# EAGLE design ESP12E Breakout Adapter (EAGLE 7.3.0)
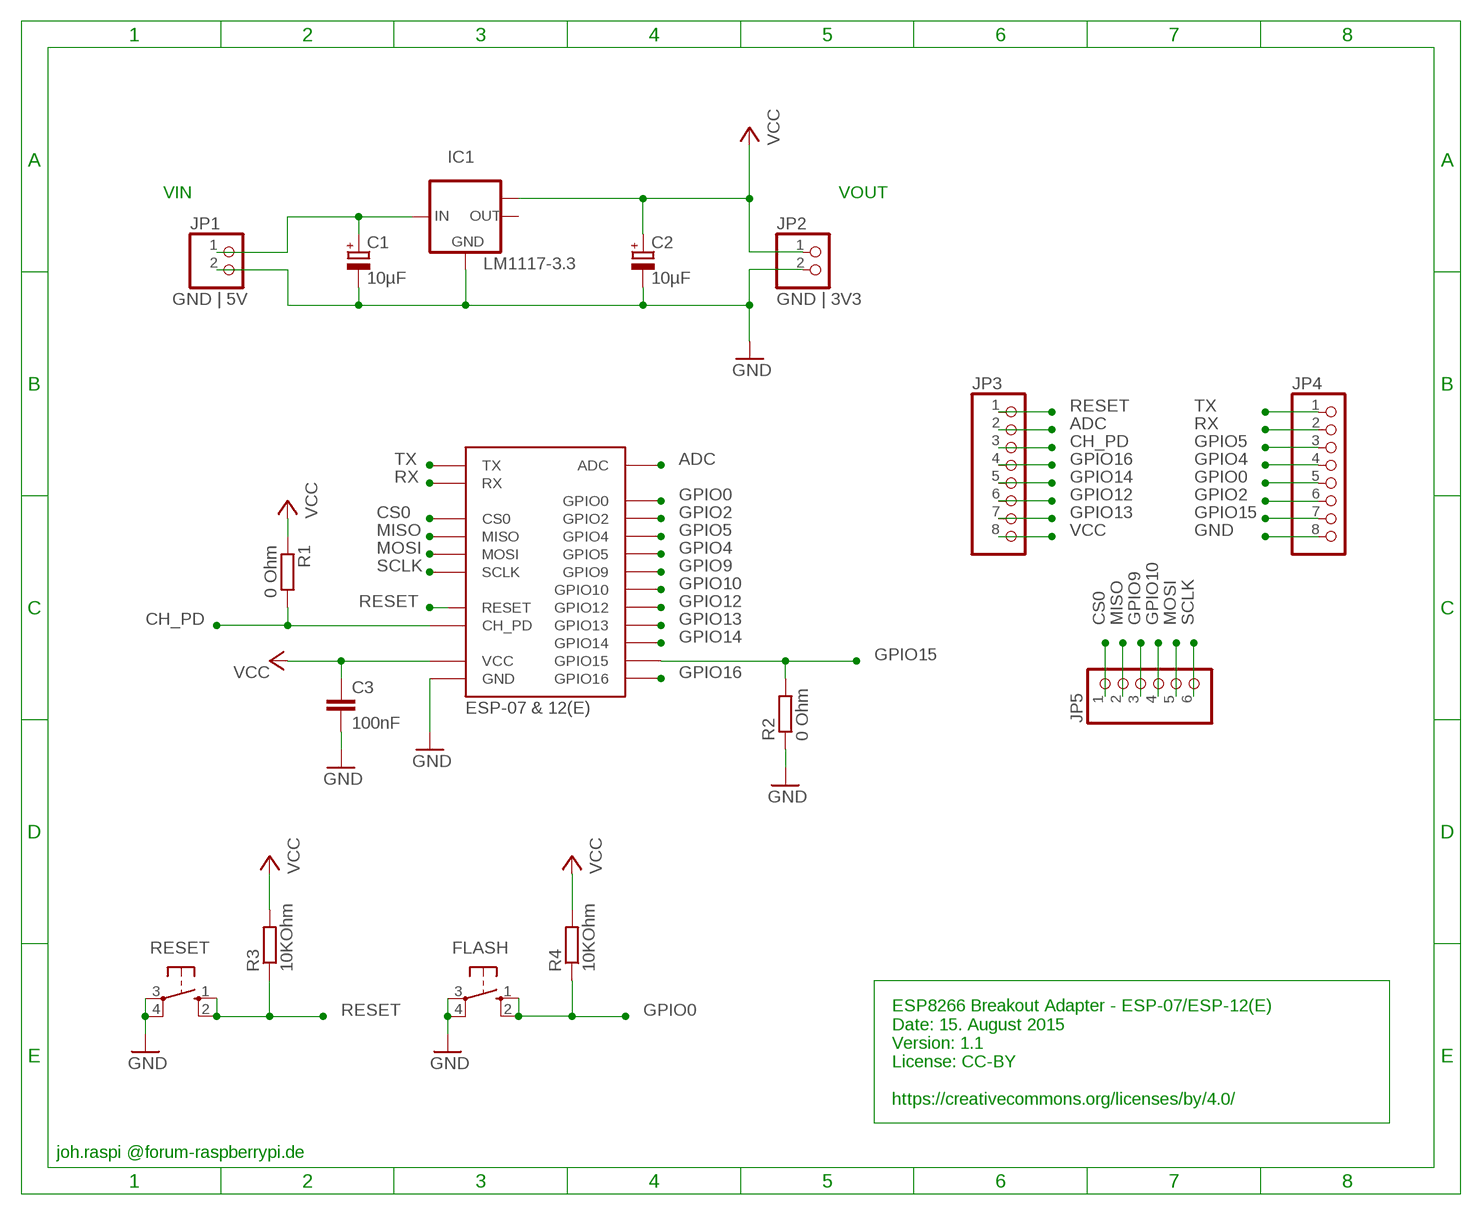
[diagram p0: schematic, sheet 1]

## Parts
C1  10µF  CPOL-EUB/3528-21W  [B/3528-21W]
C2  10µF  CPOL-EUB/3528-21W  [B/3528-21W]
C3  100nF  C-EUC0805K  [C0805K]
ESP8266  ESP-07 & 12(E)  ESP-12-E  [ESP-12-E]
FLASH_SWITCH  FLASH  10-XX  [B3F-10XX]
IC1  LM1117-3.3  LM1117MPX-3.3  [SOT223]
JP1  GND | 5V  PINHD-1X2  [1X02]
JP2  GND | 3V3  PINHD-1X2  [1X02]
JP3  PINHD-1X8  [1X08]
JP4  PINHD-1X8  [1X08]
JP5  PINHD-1X6  [1X06]
R1  0 Ohm  R-EU_R0805  [R0805]
R2  0 Ohm  R-EU_R0805  [R0805]
R3  10KOhm  R-EU_R0805  [R0805]
R4  10KOhm  R-EU_R0805  [R0805]
RESET_SWITCH  RESET  10-XX  [B3F-10XX]

## Nets
ADC: ESP8266.ADC JP3.2
CH_PD: ESP8266.CH_PD JP3.3 R1.2
CS0: ESP8266.CS0 JP5.1
GND [a]: C1.- C2.- C3.2 ESP8266.GND FLASH_SWITCH.3(P) FLASH_SWITCH.4(P1) IC1.1(GND) JP1.2 JP2.2 JP4.8 R2.1 RESET_SWITCH.3(P) RESET_SWITCH.4(P1)
GPIO0: ESP8266.GPIO0 FLASH_SWITCH.1(S) FLASH_SWITCH.2(S1) JP4.5 R4.1
GPIO2: ESP8266.GPIO2 JP4.6
GPIO4: ESP8266.GPIO5 JP4.4
GPIO5: ESP8266.GPIO4 JP4.3
GPIO9: ESP8266.GPIO9 JP5.3
GPIO10: ESP8266.GPIO10 JP5.4
GPIO12: ESP8266.GPIO12 JP3.6
GPIO13: ESP8266.GPIO13 JP3.7
GPIO14: ESP8266.GPIO14 JP3.5
GPIO15: ESP8266.GPIO15 JP4.7 R2.2
GPIO16: ESP8266.GPIO16 JP3.4
MISO: ESP8266.MISO JP5.2
MOSI: ESP8266.MOSI JP5.5
RESET: ESP8266.RESET JP3.1 R3.1 RESET_SWITCH.1(S) RESET_SWITCH.2(S1)
RX: ESP8266.RX JP4.2
SCLK: ESP8266.SCLK JP5.6
TX: ESP8266.TX JP4.1
VCC: C2.+ C3.1 ESP8266.VCC IC1.TAB(OUT1) JP2.1 JP3.8 R1.1 R3.2 R4.2
VIN: C1.+ IC1.3(IN) JP1.1
Unconnected: IC1.2(OUT)

## Notes on the sheet
- VIN | VOUT
- ESP8266 Breakout Adapter - ESP-07/ESP-12(E)
  Date: 15. August 2015
  Version: 1.1
  License: CC-BY
  
  https://creativecommons.org/licenses/by/4.0/
- joh.raspi @forum-raspberrypi.de

## Library data of the parts
C1 C2 = rcl:CPOL-EU: POLARIZED CAPACITOR, European symbol
C3 = rcl:C-EU: CAPACITOR, European symbol
ESP8266 = johs_esp8266_lib_frank_esp12e_mod:ESP-12-E: ESP8266 Wifi Module ESP-12-E; DIMENSIONS: 24.0 x 16.0 mm; PINS: 22; PITCH: 0.078" / 2 mm
FLASH_SWITCH RESET_SWITCH = switch-omron:10-XX: OMRON SWITCH; MPN: B3F-1000; OC_FARNELL: 176432; OC_NEWARK: 36M3542
IC1 = lm1117:LM1117MPX-*
JP1 JP2 = pinhead:PINHD-1X2: PIN HEADER
JP3 JP4 = pinhead:PINHD-1X8: PIN HEADER
JP5 = pinhead:PINHD-1X6: PIN HEADER
R1-R4 = rcl:R-EU_: RESISTOR, European symbol

## Net classes
1 a: width 0.203 mm, drill 0.305 mm, clearance 0.203 mm

## Board
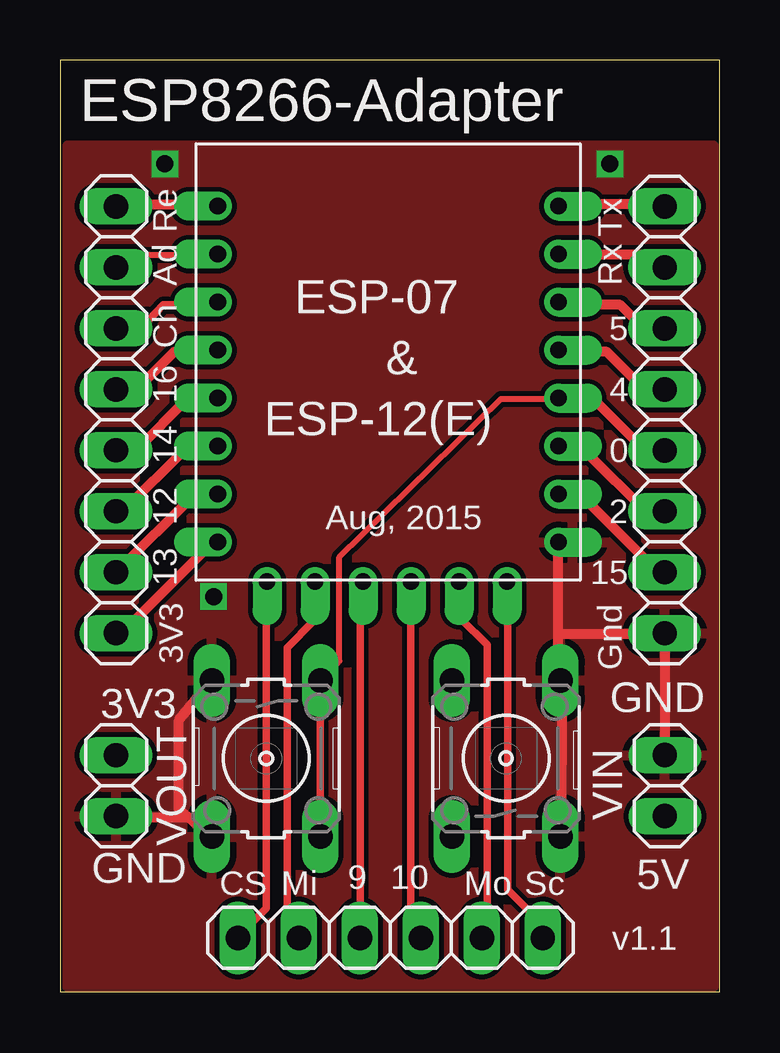
[diagram p1: board, top side]
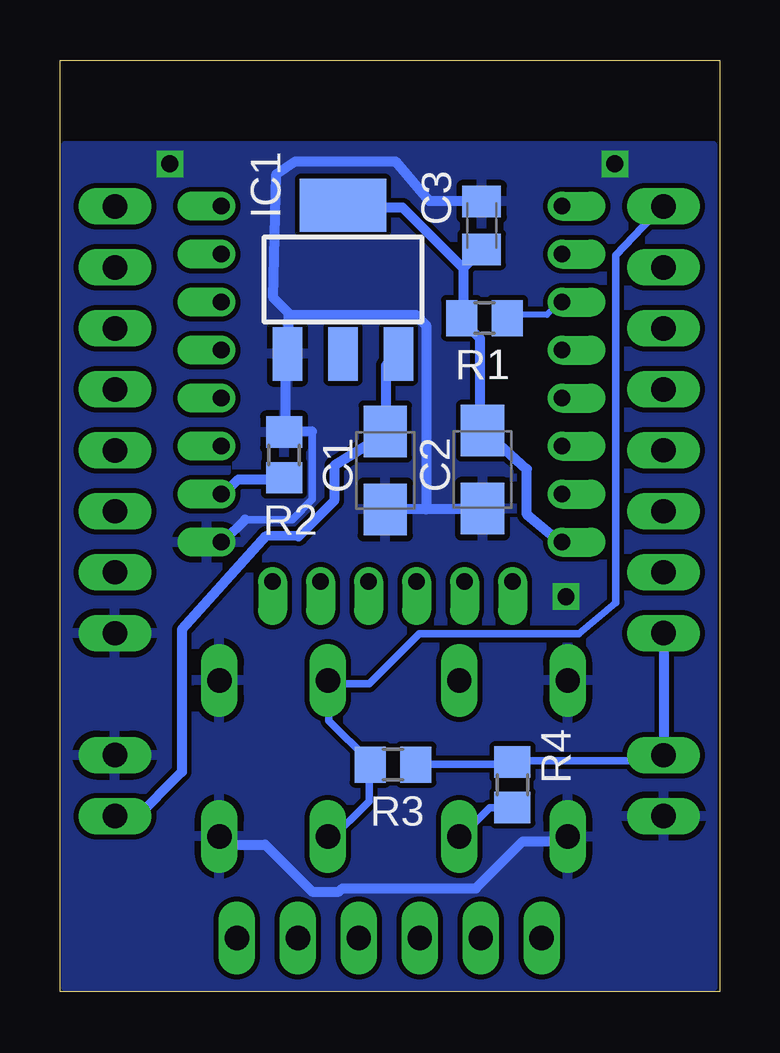
[diagram p2: board, bottom side, seen from below]

Size 27.48 x 38.83 mm. Coordinates in mm from the lower left corner, seen from the top.
Outline: 0,0 27.48,0 27.48,38.83 0,38.83 0,0
Copper layers (1*16): Top 0.035mm / dielectric 1.5mm / Bottom 0.035mm
Design rules "default *": minimum track width 10mil, minimum drill 24mil, track to track 8mil, track to pad 8mil, pad to pad 8mil, via to via 8mil, smd to smd 8mil, copper to edge 0mil, drill to drill 8mil, minimum pad ring 10mil, minimum via ring 8mil, stop-mask expansion 4mil, vias tented up to drill 0mil, thermal gap 10mil

### Footprints (pad centres in the part's own frame; a part is rotated, then mirrored left to right if it is on the bottom)
B/3528-21W = smd 2.15 x 1.8: + 1.625,0; - -1.625,0
C0805K = smd 1.3 x 1.6: 1 -1,0; 2 1,0
ESP-12-E = drill 0.7 offset: ADC -7.2,3.8; CH_PD -7.2,1.8; CS0 -5.14,-9.838; GND 7,-8.2; GPIO0 7,-2.2; GPIO2 7,-4.2; GPIO4 7,1.8; GPIO5 7,-0.2; GPIO9 -1.14,-9.838; GPIO10 0.86,-9.838; GPIO12 -7.2,-4.2; GPIO13 -7.2,-6.2; GPIO14 -7.2,-2.2; GPIO15 7,-6.2; GPIO16 -7.2,-0.2; MISO -3.14,-9.838; MOSI 2.86,-9.838; RESET -7.2,5.8; RX 7,3.8; SCLK 4.86,-9.838; TX 7,5.8; VCC -7.2,-8.2
B3F-10XX = drill 1.016 long: 1 -3.251,2.261; 2 3.251,2.261; 3 -3.251,-2.261; 4 3.251,-2.261
SOT223 = smd 1.219 x 2.235: 1 -2.311,-3.099; 2 0,-3.099; 3 2.311,-3.099 | smd 3.6 x 2.2: TAB 0,3.099
1X02 = drill 1.016 long: 1 -1.27,0; 2 1.27,0
1X08 = drill 1.016 long: 1 -8.89,0; 2 -6.35,0; 3 -3.81,0; 4 -1.27,0; 5 1.27,0; 6 3.81,0; 7 6.35,0; 8 8.89,0
1X06 = drill 1.016 long: 1 -6.35,0; 2 -3.81,0; 3 -1.27,0; 4 1.27,0; 5 3.81,0; 6 6.35,0
R0805 = smd 1.3 x 1.5: 1 -0.95,0; 2 0.95,0

### Placement (x,y rotation side)
C1  13.93,21.73 90 bottom
C2  9.88,21.77 90 bottom
C3  9.92,31.94 90 bottom
ESP8266  13.77,26.95 0 top
FLASH_SWITCH  8.59,9.73 270 top
IC1  15.69,29.69 0 bottom
JP1  25.2,8.6 90 top
JP2  2.34,8.6 270 top
JP3  2.34,23.84 270 top
JP4  25.2,23.84 270 top
JP5  13.77,2.25 0 top
R1  9.8,28.08 0 bottom
R2  18.15,22.38 270 bottom
R3  13.61,9.47 0 bottom
R4  8.64,8.64 90 bottom
RESET_SWITCH  18.59,9.73 90 top

### Tracks (layer width: path | path; a pad name or v marks a point on that pad's centre or on a via)
ADC
  Top 0.254: 2.87,30.72 6.64,30.72
  Top 0.305: 2.45,30.3 2.87,30.72
  Top 0.406: 6.64,30.72 ESP8266.ADC | 2.45,30.3 JP3.2
CH_PD
  Top 0.305: 6.64,28.63 4.31,28.63 3.39,27.66
  Top 0.406: 6.64,28.63 ESP8266.CH_PD | 3.39,27.66 JP3.3
  Bottom 0.254: 8.74,28.21 7.2,28.21 6.78,28.63
  Bottom 0.406: 8.74,28.21 R1.2 | 6.78,28.63 ESP8266.CH_PD
CS0
  Top 0.305: 8.6,17.08 8.6,3.48 7.48,2.36
  Top 0.406: 8.6,17.08 ESP8266.CS0 | 7.48,2.36 JP5.1
GND  (via drill 0.7)
  Top 0.406: 5.39,7.25 2.45,7.25 JP2.2 | 5.39,7.25 6.22,6.42 FLASH_SWITCH.4 | 5.39,7.25 4.95,7.58 4.95,11.32 FLASH_SWITCH.3 | 20.91,12.64 20.89,6.28 RESET_SWITCH.3 | 24.94,9.51 JP1.2 25.2,14.87 24.94,14.8 JP4.8 25.08,14.94 20.75,14.94 | 20.75,14.94 20.75,12.84 RESET_SWITCH.4 | 20.75,14.94 20.75,18.71 ESP8266.GND
  Bottom 0.305: 16.98,23.36 16.98,20.52 17.82,19.69 19.77,19.69
  Bottom 0.406: 12.23,20.11 10.41,20.11 10,20.52 C2.- | 12.23,20.11 13.91,20.11 C1.- | 17.96,28.21 17.96,26.67 IC1.1 18.1,26.53 18.1,23.46 R2.1 17.96,23.32 16.98,23.36 | 17.96,28.21 17.96,28.28 18.59,28.92 18.47,34.08 17.68,34.61 13.51,34.61 12.12,32.96 10,32.96 C3.2 | 12.23,20.11 12.23,27.79 12.65,28.21 17.96,28.21 | FLASH_SWITCH.4 6.36,6.28 8.2,6.28 10.16,4.32 15.72,4.32 15.86,4.18 16.98,4.18 18.94,6.14 20.75,6.14 RESET_SWITCH.3 | 19.77,19.69 20.61,18.85 ESP8266.GND
  other vias: 6.4,16.47 4.37,34.51 22.91,34.51
  pour Top: 0.31,0.22 27.23,0.22 27.23,35.27 0.31,35.27
  pour Bottom: 0.31,0.22 27.23,0.22 27.23,35.27 0.31,35.27
GPIO0
  Top 0.254: 20.47,24.72 18.38,24.72 11.64,18.12 11.64,13.79 10.97,12.98
  Top 0.305: 10.83,6.42 10.83,12.84 | 10.97,12.98 FLASH_SWITCH.1
  Top 0.406: JP4.5 24.32,22.62 22.23,24.72 20.75,24.72 ESP8266.GPIO0 20.47,24.72 | 10.83,12.84 FLASH_SWITCH.1 | 10.83,6.42 FLASH_SWITCH.2
  Bottom 0.305: 8.74,7.67 9.58,7.67 10.83,6.42
  Bottom 0.406: 8.74,7.67 R4.1 | 10.83,6.42 FLASH_SWITCH.2
GPIO2
  Top 0.406: ESP8266.GPIO2 20.75,22.62 22.06,22.37 24.32,20.11 JP4.6
GPIO4
  Top 0.406: ESP8266.GPIO5 20.75,26.67 22.78,26.67 24.32,25.13 JP4.4
GPIO5
  Top 0.406: ESP8266.GPIO4 20.75,28.63 23.34,28.63 24.32,27.65 JP4.3
GPIO9
  Top 0.305: 12.51,2.36 12.51,17.08
  Top 0.406: 12.51,17.08 ESP8266.GPIO9 | 12.51,2.36 JP5.3
GPIO10
  Top 0.305: 14.61,2.78 14.61,17.08
  Top 0.406: 14.61,2.78 15.02,2.36 JP5.4 | 14.61,17.08 ESP8266.GPIO10
GPIO12
  Top 0.406: ESP8266.GPIO12 6.64,22.62 5.22,22.62 2.71,20.11 JP3.6
GPIO13
  Top 0.406: ESP8266.GPIO13 6.64,20.66 5.53,20.66 2.45,17.59 JP3.7
GPIO14
  Top 0.406: ESP8266.GPIO14 6.64,24.72 5.31,24.72 3.21,22.62 JP3.5
GPIO15
  Top 0.406: ESP8266.GPIO15 20.75,20.66 21.76,20.66 24.83,17.59 JP4.7
  Bottom 0.406: R2.2 18.24,21.36 20.05,21.36 20.61,20.8 ESP8266.GPIO15
GPIO16
  Top 0.406: ESP8266.GPIO16 6.64,26.67 4.75,26.67 3.21,25.13 JP3.4
MISO
  Top 0.305: 10.55,17.08 10.55,15.44 9.46,14.35 9.46,2.76
  Top 0.406: 9.46,2.76 9.86,2.36 JP5.2 | 10.55,17.08 ESP8266.MISO
MOSI
  Top 0.305: 16.7,17.08 16.7,15.56 17.79,14.47 17.79,3.38
  Top 0.406: 16.7,17.08 ESP8266.MOSI | 17.79,3.38 JP5.5
RESET
  Top 0.406: ESP8266.RESET 6.64,32.82 2.45,32.82 JP3.1
  Bottom 0.305: 14.61,9.35 14.61,7.95 16.28,6.28 | 16.28,12.7 16.28,11.3 14.61,9.63 | 2.45,32.68 4.33,30.71 4.33,16.22 5.88,14.92 12.52,14.92 14.61,12.84 16.14,12.84 RESET_SWITCH.2
  Bottom 0.406: 14.61,9.35 R3.1 14.61,9.63 | 16.28,6.28 RESET_SWITCH.1 | 16.28,12.7 RESET_SWITCH.2 | 2.45,32.68 JP3.1
RX
  Top 0.406: ESP8266.RX 20.75,30.72 24.66,30.72 25.08,30.3 JP4.2
SCLK
  Top 0.305: 18.66,17.08 18.66,4.27 20.05,2.87
  Top 0.406: 18.66,17.08 ESP8266.SCLK | 20.05,2.87 JP5.6
TX
  Top 0.406: ESP8266.TX 20.75,32.82 25.08,32.82 JP4.1
VCC
  Top 0.406: ESP8266.VCC 6.64,18.71 6.34,18.71 2.71,15.08 JP3.8
  Bottom 0.305: 8.74,9.49 12.65,9.49 | 2.59,9.63 8.46,9.63
  Bottom 0.406: 10.69,30.16 10.69,28.21 R1.1 10.69,27.93 10,27.23 10,24.02 C2.+ 9.86,23.74 9.86,23.43 8.03,21.78 8.03,19.89 6.78,18.85 ESP8266.VCC | 10.69,30.16 10,30.86 C3.1 | 10.69,30.16 13.21,32.68 15.58,32.68 IC1.TAB | 12.65,9.49 R3.2 | 8.74,9.49 R4.2 8.46,9.63 | 2.59,9.63 2.45,9.77 JP2.1 2.31,10.05 2.31,14.94 JP3.8
VIN
  Bottom 0.406: IC1.3 13.49,26.53 13.91,26.11 13.91,23.46 C1.+ 14.05,23.18 16.07,21.92 16.07,20.46 17.54,18.99 18.88,19 22.4,15.1 22.4,9.17 24.44,7.14 JP1.1

### Text on the board
tPlace: ESP8266-Adapter | Re | Ad | Tx | Rx | Ch | 5 | 16 | 4 | 14 | 0 | 12 | Aug, 2015 | 2 | 13 | 15 | 3V3 | Gnd | 3V3 | VOUT | GND | VIN | 5V | GND | CS | Mi | 9 | 10 | Mo | Sc | v1.1